# EAGLE schematic PCB Schematic (EAGLE 9.7.0)
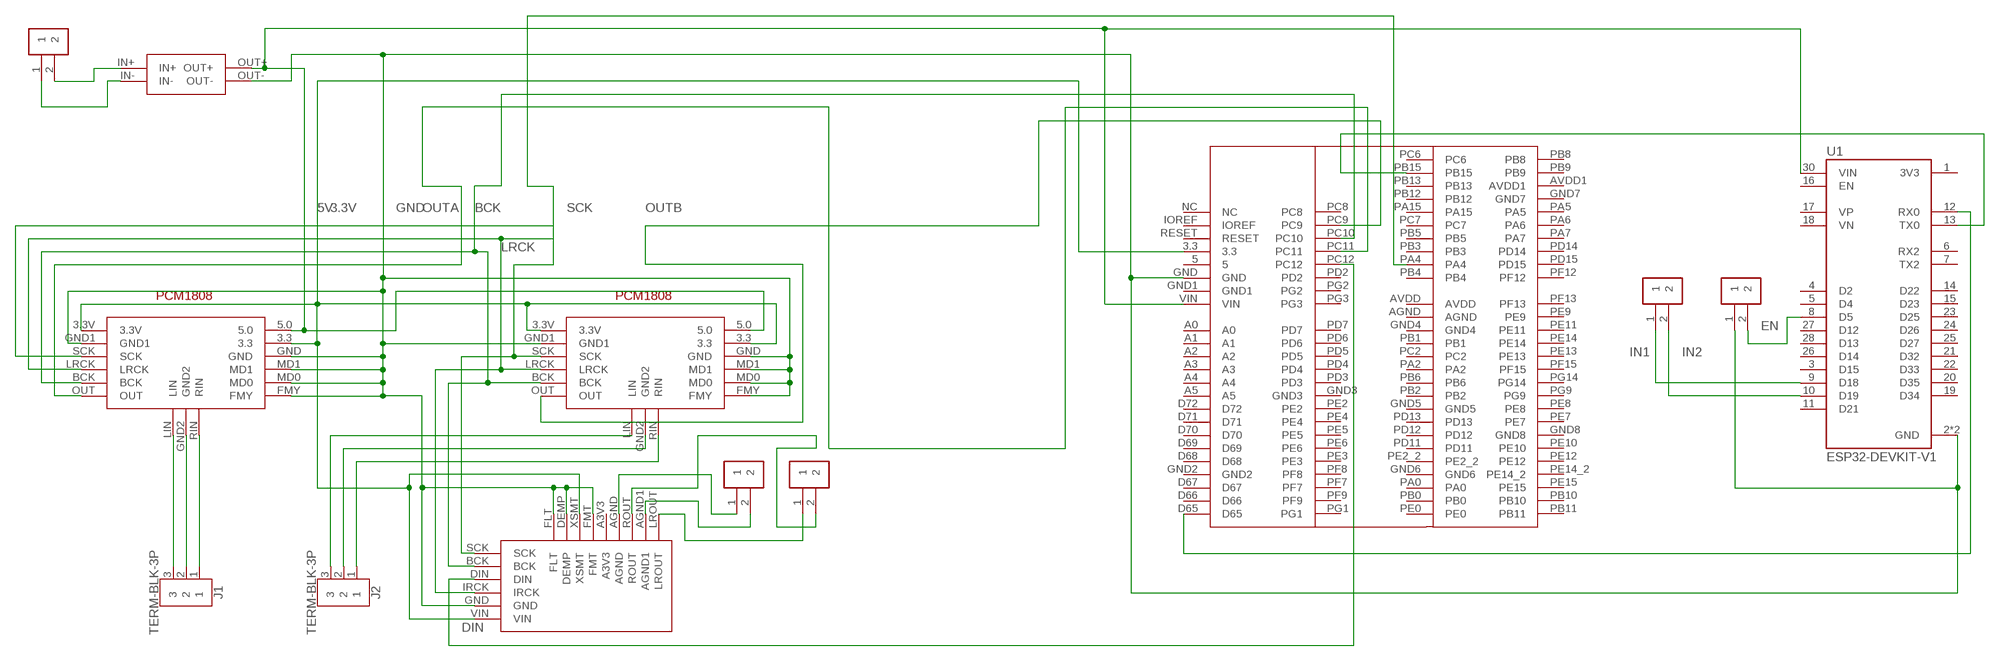
[diagram p0: schematic, sheet 1]

## Parts
A1  NUCLEO-F767ZI  [ST_NUCLEO-F767ZI]
J1  TERM-BLK-3P  2828XX-3282837-3  [TERMBLK_508-3N]
J2  TERM-BLK-3P  2828XX-3282837-3  [TERMBLK_508-3N]
PCM2  PCM5102A  [DAC]
U1  ESP32-DEVKIT-V1  [MODULE_ESP32_DEVKIT_V1]
U$1  PCM1808REVERSE  [ADCREVERSE]
U$2  PCM1808REVERSE  [ADCREVERSE]
U$3  LM2596  [LM2596]
U$4  TERMINAL2  [TERMINAL]
U$5  TERMINAL2  [TERMINAL]
U$7  TERMINAL2  [TERMINAL]
U$8  TERMINAL2  [TERMINAL]
U$10  TERMINAL2  [TERMINAL]

## Nets
3.3V: A1.3.3 PCM2.VIN PCM2.XSMT U$1.3.3 U$1.3.3V U$2.3.3 U$2.3.3V
5V: A1.VIN U1.30(VIN) U$1.5.0 U$2.5.0 U$3.OUT+
BCK: A1.PC10 PCM2.BCK U$1.BCK U$2.BCK
DIN: A1.PC12 PCM2.DIN
EN: U1.8(D5) U$5.2
GND: A1.GND PCM2.DEMP PCM2.FLT PCM2.FMT PCM2.GND U1.2(GND) U1.29(GND) U$1.FMY U$1.GND U$1.GND1 U$1.MD0 U$1.MD1 U$2.FMY U$2.GND U$2.GND1 U$2.MD0 U$2.MD1 U$3.OUT- U$5.1
IN1: U1.9(D18) U$4.1
IN2: U1.10(D19) U$4.2
LRCK: A1.PA4 PCM2.IRCK U$1.LRCK U$2.LRCK
N$1: J1.3 U$1.LIN
N$2: J1.2 U$1.GND2
N$3: J1.1 U$1.RIN
N$4: J2.3 U$2.LIN
N$5: J2.2 U$2.GND2
N$6: J2.1 U$2.RIN
N$7: A1.D65 U1.12(RX0)
N$8: A1.PB15 U1.13(TX0)
N$9: PCM2.AGND U$8.1
N$10: PCM2.AGND1 U$8.2
N$11: PCM2.ROUT U$7.2
N$12: PCM2.LROUT U$7.1
N$14: U$3.IN+ U$10.2
N$15: U$3.IN- U$10.1
OUTA: A1.PC11 U$1.OUT
OUTB: A1.PC9 U$2.OUT
SCK: PCM2.SCK U$1.SCK U$2.SCK
Unconnected: A1.5 A1.A0 A1.A1 A1.A2 A1.A3 A1.A4 A1.A5 A1.AGND A1.AVDD A1.AVDD1 A1.D66 A1.D67 A1.D68 A1.D69 A1.D70 A1.D71 A1.D72 A1.GND1 A1.GND2 A1.GND3 A1.GND4 A1.GND5 A1.GND6 A1.GND7 A1.GND8 A1.IOREF A1.NC A1.PA0 A1.PA2 A1.PA5 A1.PA6 A1.PA7 A1.PA15 A1.PB0 A1.PB1 A1.PB2 A1.PB3 A1.PB4 A1.PB5 A1.PB6 A1.PB8 A1.PB9 A1.PB10 A1.PB11 A1.PB12 A1.PB13 A1.PC2 A1.PC6 A1.PC7 A1.PC8 A1.PD2 A1.PD3 A1.PD4 A1.PD5 A1.PD6 A1.PD7 A1.PD11 A1.PD12 A1.PD13 A1.PD14 A1.PD15 A1.PE0 A1.PE2 A1.PE2_2 A1.PE3 A1.PE4 A1.PE5 A1.PE6 A1.PE7 A1.PE8 A1.PE9 A1.PE10 A1.PE11 A1.PE12 A1.PE13 A1.PE14 A1.PE14_2 A1.PE15 A1.PF7 A1.PF8 A1.PF9 A1.PF12 A1.PF13 A1.PF15 A1.PG1 A1.PG2 A1.PG3 A1.PG9 A1.PG14 A1.RESET PCM2.A3V3 U1.1(3V3) U1.3(D15) U1.4(D2) U1.5(D4) U1.6(RX2) U1.7(TX2) U1.11(D21) U1.14(D22) U1.15(D23) U1.16(EN) U1.17(VP) U1.18(VN) U1.19(D34) U1.20(D35) U1.21(D32) U1.22(D33) U1.23(D25) U1.24(D26) U1.25(D27) U1.26(D14) U1.27(D12) U1.28(D13)

## Library data of the parts
A1 = STMH7:NUCLEO-F767ZI: STM32 Nucleo-144 development board with STM32F767ZI MCU, supports Arduino, ST Zio and morpho connectivity Check availability <https://pricing.snapeda.com/parts/NUCLEO-F767ZI/STMicroelectronics/view-part?ref=eda>; AVAILABILITY: In Stock; CHECK_PRICES: https://www.snapeda.com/parts/NUCLEO-F767ZI/STMicroelectronics/view-part/?ref=eda; DESCRIPTION: STM32F767, mbed-Enabled Development Nucleo-144 STM32F7 ARM® Cortex®-M7 MCU 32-Bit Embedded Evaluation Board; MF: STMicroelectronics; MP: NUCLEO-F767ZI; PACKAGE: None; PRICE: None; SNAPEDA_LINK: https://www.snapeda.com/parts/NUCLEO-F767ZI/STMicroelectronics/view-part/?ref=snap
J1 J2 = Connector:2828XX-3: 3 Position Wire to Board Terminal Block Horizontal with Board Datasheet <https://www.te.com.cn/commerce/DocumentDelivery/DDEController?Action=showdoc&DocId=Catalog+Section%7F1308389_EUROSTYLE_TERMINAL_BLOCKS%7F0607%7Fpdf%7FEnglish%7FENG_CS_1308389_EUROSTYLE_TERMINAL_BLOCKS_0607.pdf%7F2-282837-5>; CATEGORY: Connector; DESCRIPTION: TERM BLK 3P SIDE ENT 5.08mm PCB; MANUFACTURER: TE Connectivity; MPN: 282837-3; OPERATING_TEMPERATURE: -40°C to +105°C; PART_STATUS: Active; PITCH: 0.200" (5.08mm); ROHS_COMPLIANCE: RoHS Compliant; SERIES: Buchanan; SUBCATEGORY: Terminal Block; TYPE: Side Wire Entry
PCM2 = PCM:PCM5102A
U1 = ESP32-DEVKIT-V1:ESP32-DEVKIT-V1: Dual core, Wi-Fi: 2.4 GHz up to 150 Mbits/s,BLE (Bluetooth Low Energy) and legacy Bluetooth, 32 bits, Up to 240 MHz Check availability <https://pricing.snapeda.com/parts/ESP32-DEVKIT-V1/Do%20it/view-part?ref=eda>; AVAILABILITY: Not in stock; CHECK_PRICES: https://www.snapeda.com/parts/ESP32-DEVKIT-V1/Do+it/view-part/?ref=eda; DESCRIPTION: Dual core, Wi-Fi: 2.4 GHz up to 150 Mbits/s,BLE (Bluetooth Low Energy) and legacy Bluetooth, 32 bits, Up to 240 MHz; MF: Do it; MP: ESP32-DEVKIT-V1; PACKAGE: None; PRICE: None; SNAPEDA_LINK: https://www.snapeda.com/parts/ESP32-DEVKIT-V1/Do+it/view-part/?ref=snap
U$1 U$2 = PCM:PCM1808REVERSE
U$3 = REGULATOR:LM2596
U$4 U$5 U$7 U$8 U$10 = REGULATOR:TERMINAL2